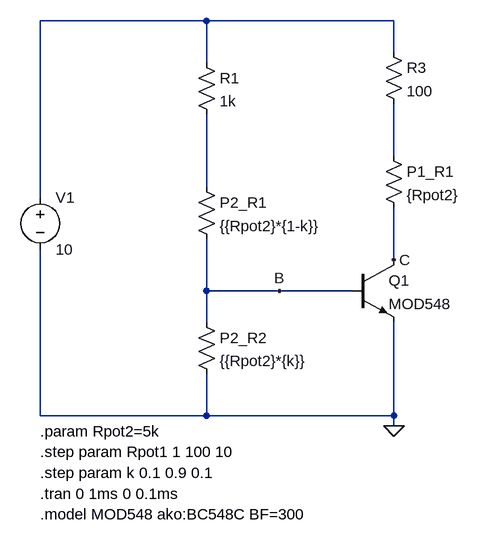
[diagram p0: schematic Circuito2 (copia 1).asc]
Circuito2 (copia 1).asc, the LTspice schematic file:
Version 4
SHEET 1 880 680
WIRE -32 -192 -288 -192
WIRE 256 -192 -32 -192
WIRE 256 -144 256 -192
WIRE -32 -128 -32 -192
WIRE 256 16 256 -64
WIRE -32 64 -32 -48
WIRE -288 80 -288 -192
WIRE 256 176 256 96
WIRE -32 224 -32 144
WIRE 80 224 -32 224
WIRE 192 224 80 224
WIRE -32 272 -32 224
WIRE -288 416 -288 160
WIRE -32 416 -32 352
WIRE -32 416 -288 416
WIRE 256 416 256 272
WIRE 256 416 -32 416
WIRE 256 432 256 416
FLAG 256 176 C
FLAG 80 224 B
FLAG 256 432 0
SYMBOL npn 192 176 R0
SYMATTR InstName Q1
SYMATTR Value MOD548
SYMBOL voltage -288 64 R0
WINDOW 123 0 0 Left 0
WINDOW 39 0 0 Left 0
SYMATTR InstName V1
SYMATTR Value 10
SYMBOL res 240 -160 R0
SYMATTR InstName R3
SYMATTR Value 100
SYMBOL res -48 -144 R0
SYMATTR InstName R1
SYMATTR Value 1k
SYMBOL res 240 0 R0
SYMATTR InstName P1_R1
SYMATTR Value {Rpot2}
SYMBOL res -48 48 R0
SYMATTR InstName P2_R1
SYMATTR Value {{Rpot2}*{1-k}}
SYMBOL res -48 256 R0
SYMATTR InstName P2_R2
SYMATTR Value {{Rpot2}*{k}}
TEXT -288 536 Left 2 !.tran 0 1ms 0 0.1ms
TEXT -288 568 Left 2 !.model MOD548 ako:BC548C BF=300
TEXT -288 440 Left 2 !.param Rpot2=5k
TEXT -288 504 Left 2 !.step param k 0.1 0.9 0.1
TEXT -288 472 Left 2 !.step param Rpot1 1 100 10

The netlist it stands for:
* Circuito2 (copia 1).asc
Q1 C B 0 0 MOD548
V1 N001 0 10
R3 N001 N002 100
R1 N001 N003 1k
R§P1_R1 N002 C {Rpot2}
R§P2_R1 N003 B {{Rpot2}*{1-k}}
R§P2_R2 B 0 {{Rpot2}*{k}}
.model NPN NPN
.model PNP PNP
.lib standard.bjt
.tran 0 1ms 0 0.1ms
.model MOD548 ako:BC548C BF=300
.param Rpot2=5k
.step param k 0.1 0.9 0.1
.step param Rpot1 1 100 10
.backanno
.end